# EAGLE design Watch (EAGLE 7.6.0)
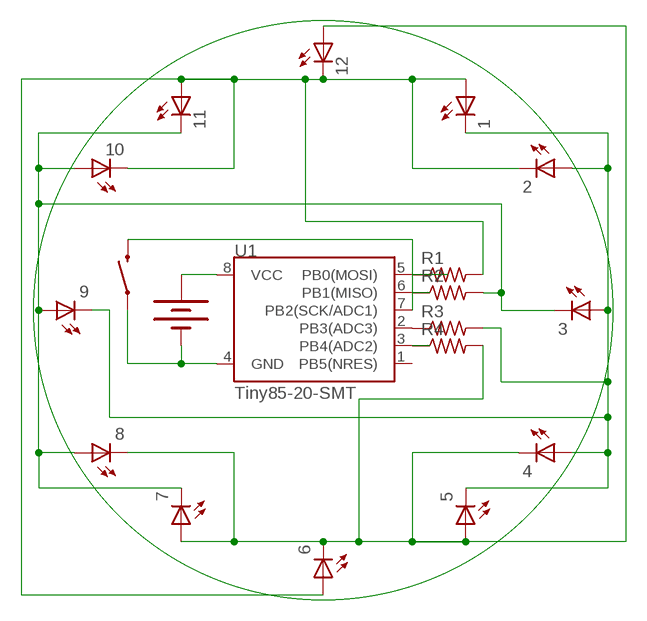
[diagram p0: schematic, sheet 1]

## Parts
1  LEDCHIPLED_0805  [CHIPLED_0805]
2  LEDCHIPLED_0805  [CHIPLED_0805]
3  LEDCHIPLED_0805  [CHIPLED_0805]
4  LEDCHIPLED_0805  [CHIPLED_0805]
5  LEDCHIPLED_0805  [CHIPLED_0805]
6  LEDCHIPLED_0805  [CHIPLED_0805]
7  LEDCHIPLED_0805  [CHIPLED_0805]
8  LEDCHIPLED_0805  [CHIPLED_0805]
9  LEDCHIPLED_0805  [CHIPLED_0805]
10  LEDCHIPLED_0805  [CHIPLED_0805]
11  LEDCHIPLED_0805  [CHIPLED_0805]
12  LEDCHIPLED_0805  [CHIPLED_0805]
BAT1  20mm coincell  BATTERY20MM_4LEGS  [BATTCON_20MM_4LEGS]
R1  R-US_M0805  [M0805]
R2  R-US_M0805  [M0805]
R3  R-US_M0805  [M0805]
R4  R-US_M0805  [M0805]
S2  SWITCH-MOMENTARY-2SMD  [TACTILE-SWITCH-SMD]
U1  Tiny85-20-SMT  ATTINY45TINY45-20-SMT  [SO08-EIAJ]

## Nets
N$1: 1.C 2.A 3.A 4.A 5.C 9.C R3.2
N$2: 4.C 5.A 6.C 7.A 8.C 12.A R4.2
N$3: 3.C 7.C 8.A 9.A 10.A 11.C R2.2
N$4: 1.A 2.C 6.A 10.C 11.A 12.C R1.2
N$5: R1.1 U1.5(PB0(MOSI))
N$6: R2.1 U1.6(PB1(MISO))
N$7: R3.1 U1.2(PB3(ADC3))
N$8: R4.1 U1.3(PB4(ADC2))
N$9: BAT1.NEGATIVE(-) S2.1 U1.4(GND)
N$10: S2.3 U1.7(PB2(SCK/ADC1))
N$12: BAT1.POSITIVE@1(+) BAT1.POSITIVE@2(+) BAT1.POSITIVE@3(+) BAT1.POSITIVE@4(+) U1.8(VCC)
Unconnected: U1.1(PB5(NRES))

## Library data of the parts
1-12 = adafruit:LED: LED OSRAM: - CHIPLED LG R971, LG N971, LY N971, LG Q971, LY Q971, LO R971, LY R971 LH N974, LH R974 LS Q976, LO Q976, LY Q976 LO Q996 - Hyper CHIPLED LW Q18S LB Q993, LB Q99A, LB R99A - SideLED LS A670, LO A670, LY A670, LG A670, LP A670 LB A673, LV A673, LT A673, LW A673 LH A674 LY A675 LS A676, LA A676, LO A676, LY A676, LW A676 LS A679, LY A679, LG A679 - Hyper Micro SIDELED® LS Y876, LA Y876, LO Y876, LY Y876 LT Y87S - SmartLED LW L88C, LW L88S LB L89C, LB L89S, LG L890 LS L89K, LO L89K, LY L89K LS L896, LA L896, LO L896, LY L896 - TOPLED LS T670, LO T670, LY T670, LG T670, LP T670 LSG T670, LSP T670, LSY T670, LOP T670, LYG T670 LG T671, LOG T671, LSG T671 LB T673, LV T673, LT T673, LW T673 LH T674 LS T676, LA T676, LO T676, LY T676, LB T676, LH T676, LSB T676, LW T676 LB T67C, LV T67C, LT T67C, LS T67K, LO T67K, LY T67K, LW E67C LS E67B, LA E67B, LO E67B, LY E67B, LB E67C, LV E67C, LT E67C LW T67C LS T679, LY T679, LG T679 LS T770, LO T770, LY T770, LG T770, LP T770 LB T773, LV T773, LT T773, LW T773 LH T774 LS E675, LA E675, LY E675, LS T675 LS T776, LA T776, LO T776, LY T776, LB T776 LHGB T686 LT T68C, LB T68C - Hyper Mini TOPLED® LB M676 - Mini TOPLED Santana® LG M470 LS M47K, LO M47K, LY M47K Source: http://www.osram.convergy.de/
BAT1 = SparkFun-Electromechanical:BATTERY: Battery Holders Various common sizes : AA, AAA, 18650 (PRT-12895), 20mm coin cell and 12mm coin cell. 20MM_4LEGS, BATT-10373; PROD_ID: BATT-10373
R1-R4 = adafruit:R-US_: RESISTOR, American symbol
S2 = SparkFun-Electromechanical:SWITCH-MOMENTARY-2: Various NO switches- pushbuttons, reed, etc; PROD_ID: SWCH-08247
U1 = SparkFun-DigitalIC:ATTINY45: Atmel 8-pin 2/4/8kB flash uC; PROD_ID: IC-08922; VALUE: Tiny45-20-SMT

## Board
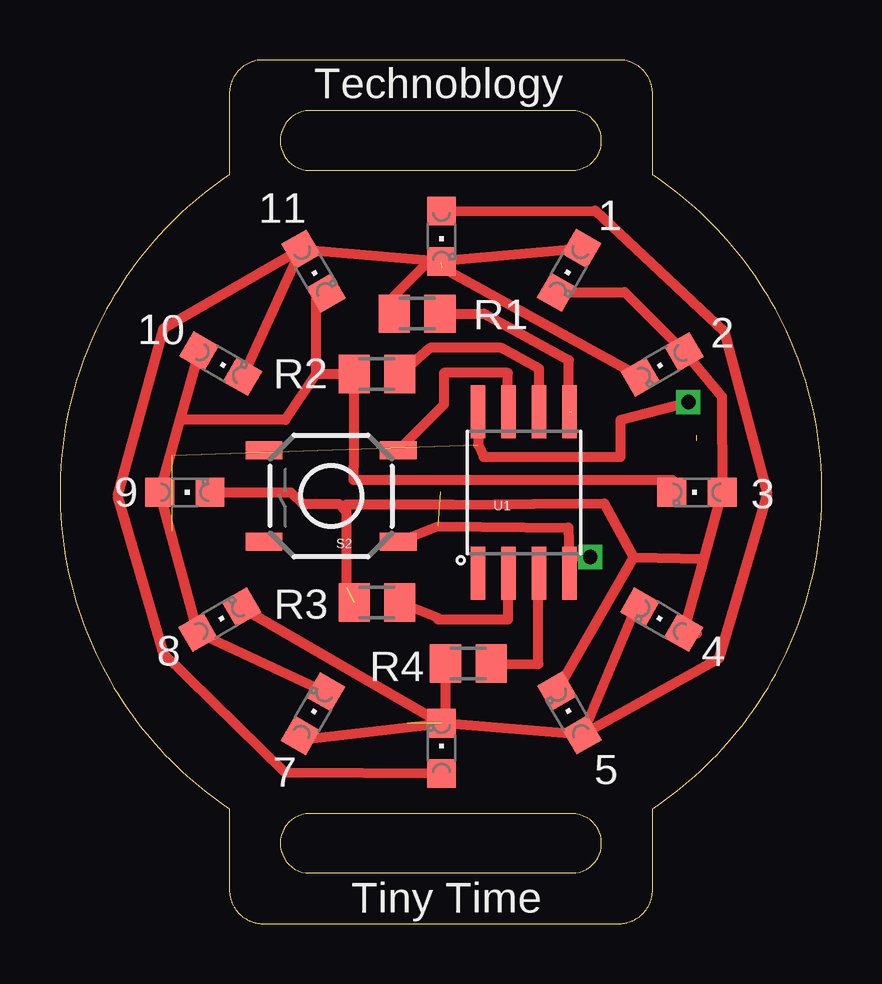
[diagram p1: board, top side]
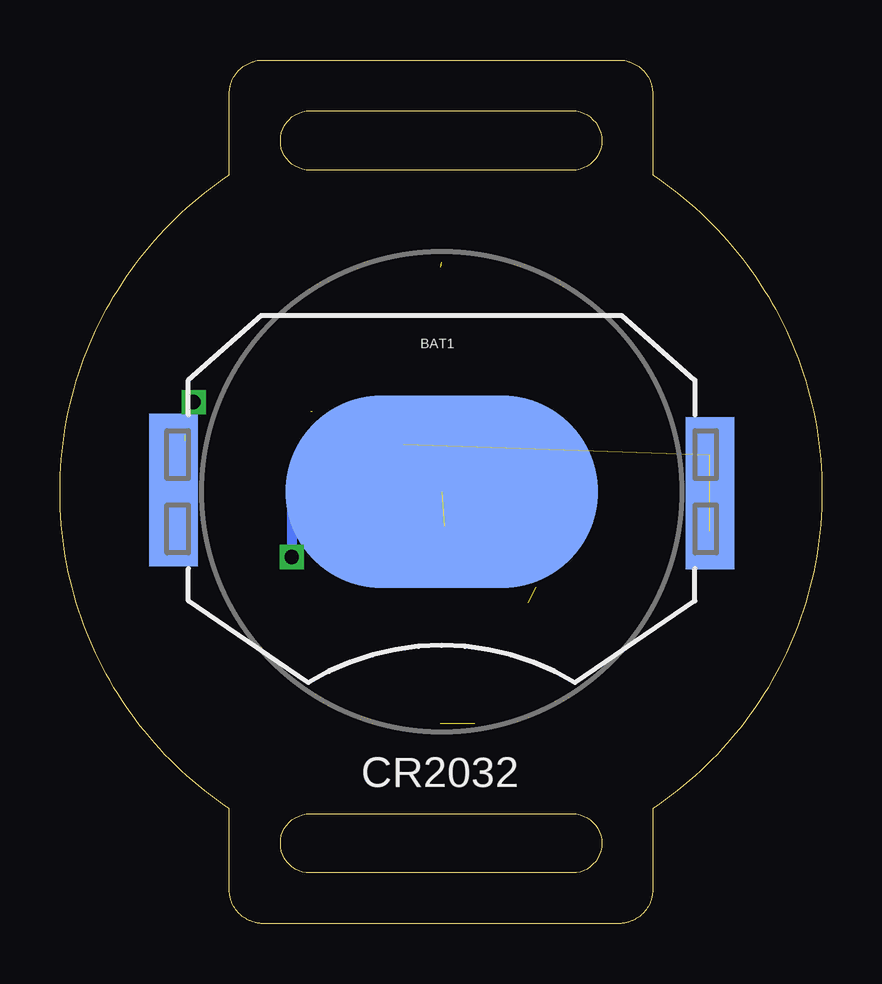
[diagram p2: board, bottom side, seen from below]

Size 31.75 x 35.98 mm. Coordinates in mm from the lower left corner, seen from the top.
Outline: 7.23,0.74 7.2,0.78 7.18,0.82 7.17,0.86 7.15,0.9 7.13,0.95 7.12,0.99 7.11,1.04 7.09,1.08 7.08,1.13 7.08,1.17 7.07,1.22 7.06,1.27 7.06,1.31 7.06,1.36 7.06,4.79 6.79,4.97 6.53,5.15 6.28,5.35 6.02,5.54 5.77,5.74 5.53,5.95 5.29,6.16 5.05,6.37 4.82,6.59 4.6,6.82 4.37,7.05 4.16,7.28 3.94,7.52 3.74,7.76 3.33,8.25 3.14,8.51 2.77,9.03 2.59,9.29 2.42,9.56 2.25,9.84 2.09,10.11 1.78,10.68 1.63,10.96 1.5,11.26 1.36,11.55 1.23,11.85 1.11,12.15 0.99,12.45 0.88,12.75 0.78,13.06 0.68,13.37 0.59,13.69 0.5,14.01 0.42,14.33 0.35,14.65 0.29,14.97 0.22,15.3 0.17,15.63 0.09,16.29 0.05,16.63 0.03,16.97 0.01,17.31 0,17.65 0,18.34 0.01,18.68 0.03,19.02 0.05,19.35 0.09,19.69 0.13,20.02 0.17,20.35 0.22,20.68 0.29,21.01 0.35,21.33 0.42,21.66 0.5,21.98 0.59,22.29 0.68,22.61 0.78,22.92 0.88,23.23 0.99,23.53 1.11,23.84 1.23,24.14 1.36,24.43 1.5,24.73 1.63,25.02 1.78,25.31 1.93,25.59 2.09,25.87 2.25,26.15 2.42,26.42 2.59,26.69 2.77,26.96 3.14,27.48 3.33,27.73 3.53,27.98 3.74,28.23 3.94,28.47 4.16,28.7 4.37,28.94 4.6,29.17 4.82,29.39 5.05,29.61 5.29,29.83 5.53,30.03 5.77,30.24 6.02,30.44 6.28,30.64 6.53,30.83 6.79,31.01 7.06,31.19 7.06,34.62 7.06,34.67 7.06,34.72 7.07,34.76 7.08,34.81 7.08,34.86 7.09,34.9 7.11,34.95 7.12,34.99 7.13,35.04 7.15,35.08 7.17,35.12 7.18,35.16 7.2,35.2 7.23,35.24 7.25,35.28 7.27,35.32 7.3,35.36 7.32,35.4 7.35,35.43 7.38,35.47 7.41,35.5 7.44,35.54 7.5,35.6 7.53,35.63 7.57,35.66 7.6,35.69 7.64,35.72 7.68,35.74 7.72,35.77 7.75,35.79 7.79,35.81 7.83,35.83 7.88,35.85 7.92,35.87 7.96,35.89 8,35.91 8.05,35.92 8.09,35.93 8.14,35.94 8.23,35.96 8.28,35.97 8.32,35.98 8.37,35.98 8.42,35.98 23.33,35.98 23.38,35.98 23.43,35.98 23.48,35.97 23.52,35.96 23.61,35.94 23.66,35.93 23.7,35.92 23.75,35.91 23.79,35.89 23.83,35.87 23.88,35.85 23.92,35.83 23.96,35.81 24,35.79 24.04,35.77 24.07,35.74 24.11,35.72 24.15,35.69 24.18,35.66 24.22,35.63 24.25,35.6 24.28,35.57 24.31,35.54 24.34,35.5 24.37,35.47 24.4,35.43 24.43,35.4 24.45,35.36 24.48,35.32 24.5,35.28 24.52,35.24 24.55,35.2 24.57,35.16 24.58,35.12 24.6,35.08 24.62,35.04 24.63,34.99 24.65,34.95 24.66,34.9 24.67,34.86 24.68,34.81 24.68,34.76 24.69,34.72 24.69,34.67 24.69,34.62 24.69,31.19 24.96,31.01 25.22,30.83 25.48,30.64 25.73,30.44 25.98,30.24 26.46,29.83 26.7,29.61 26.93,29.39 27.15,29.17 27.38,28.94 27.59,28.7 27.81,28.47 28.02,28.23 28.22,27.98 28.42,27.73 28.61,27.48 28.98,26.96 29.16,26.69 29.33,26.42 29.5,26.15 29.66,25.87 29.82,25.59 29.97,25.31 30.12,25.02 30.25,24.73 30.39,24.43 30.52,24.14 30.64,23.84 30.76,23.53 30.87,23.23 30.97,22.92 31.07,22.61 31.16,22.29 31.25,21.98 31.33,21.66 31.4,21.33 31.46,21.01 31.53,20.68 31.58,20.35 31.62,20.02 31.66,19.69 31.7,19.35 31.74,18.68 31.75,18.34 31.75,17.65 31.74,17.31 31.7,16.63 31.66,16.29 31.58,15.63 31.53,15.3 31.46,14.97 31.4,14.65 31.33,14.33 31.25,14.01 31.16,13.69 31.07,13.37 30.97,13.06 30.87,12.75 30.76,12.45 30.64,12.15 30.52,11.85 30.39,11.55 30.25,11.26 30.12,10.96 29.97,10.68 29.82,10.39 29.66,10.11 29.5,9.84 29.33,9.56 29.16,9.29 28.98,9.03 28.61,8.51 28.42,8.25 28.22,8.01 28.02,7.76 27.81,7.52 27.59,7.28 27.38,7.05 27.15,6.82 26.93,6.59 26.7,6.37 26.46,6.16 25.98,5.74 25.73,5.54 25.48,5.35 25.22,5.15 24.96,4.97 24.69,4.79 24.69,1.36 24.69,1.31 24.69,1.27 24.68,1.22 24.68,1.17 24.67,1.13 24.66,1.08 24.65,1.04 24.63,0.99 24.62,0.95 24.6,0.9 24.58,0.86 24.57,0.82 24.55,0.78 24.52,0.74 24.5,0.7 24.48,0.66 24.45,0.62 24.43,0.58 24.4,0.55 24.37,0.51 24.34,0.48 24.31,0.45 24.28,0.41 24.25,0.38 24.22,0.35 24.18,0.32 24.15,0.29 24.11,0.27 24.07,0.24 24.04,0.22 24,0.19 23.96,0.17 23.92,0.15 23.88,0.13 23.83,0.11 23.79,0.09 23.75,0.08 23.66,0.05 23.61,0.04 23.57,0.03 23.52,0.02 23.48,0.01 23.43,0.01 23.38,0 23.33,0 8.42,0 8.37,0 8.32,0.01 8.28,0.01 8.23,0.02 8.18,0.03 8.14,0.04 8.09,0.05 8.05,0.06 8,0.08 7.96,0.09 7.92,0.11 7.88,0.13 7.83,0.15 7.79,0.17 7.75,0.19 7.72,0.22 7.68,0.24 7.64,0.27 7.6,0.29 7.57,0.32 7.53,0.35 7.5,0.38 7.47,0.41 7.44,0.45 7.41,0.48 7.38,0.51 7.35,0.55 7.32,0.58 7.3,0.62 7.27,0.66 7.25,0.7
Outline: 21.5,33.86 10.24,33.86 10.08,33.82 9.93,33.76 9.79,33.7 9.65,33.61 9.54,33.5 9.43,33.39 9.34,33.25 9.28,33.11 9.21,32.96 9.18,32.79 9.18,32.45 9.21,32.29 9.28,32.14 9.34,32 9.43,31.86 9.54,31.75 9.65,31.64 9.79,31.55 9.93,31.49 10.08,31.42 10.24,31.39 21.5,31.39 21.66,31.42 21.81,31.49 21.96,31.55 22.09,31.64 22.2,31.75 22.31,31.86 22.4,32 22.47,32.14 22.53,32.29 22.56,32.45 22.56,32.79 22.53,32.96 22.47,33.11 22.4,33.25 22.31,33.39 22.2,33.5 22.09,33.61 21.96,33.7 21.81,33.76 21.66,33.82 21.5,33.86
Outline: 21.5,4.58 10.24,4.58 10.08,4.55 9.93,4.48 9.79,4.42 9.65,4.33 9.54,4.22 9.43,4.11 9.34,3.97 9.28,3.83 9.21,3.68 9.18,3.52 9.18,3.17 9.21,3.01 9.28,2.86 9.34,2.72 9.43,2.58 9.54,2.47 9.65,2.36 9.79,2.27 9.93,2.21 10.08,2.15 10.24,2.11 21.5,2.11 21.66,2.15 21.81,2.21 21.96,2.27 22.09,2.36 22.2,2.47 22.31,2.58 22.4,2.72 22.47,2.86 22.53,3.01 22.56,3.17 22.56,3.52 22.53,3.68 22.47,3.83 22.4,3.97 22.31,4.11 22.2,4.22 22.09,4.33 21.96,4.42 21.81,4.48 21.66,4.55 21.5,4.58
Copper layers (1*16): Top 0.035mm / dielectric 1.5mm / Bottom 0.035mm
Design rules "default": minimum track width 10mil, minimum drill 24mil, track to track 8mil, track to pad 8mil, pad to pad 8mil, via to via 8mil, smd to smd 8mil, copper to edge 40mil, drill to drill 8mil, minimum pad ring 10mil, minimum via ring 8mil, stop-mask expansion 4mil, vias tented up to drill 0mil, thermal gap 10mil

### Footprints (pad centres in the part's own frame; a part is rotated, then mirrored left to right if it is on the bottom)
CHIPLED_0805 = smd 1.2 x 1.2: A 0,-1.05; C 0,1.05
BATTCON_20MM_4LEGS = smd 13 x 8: NEGATIVE 0,0 | smd 2.032 x 3.175: POSITIVE@1 -11.176,1.651; POSITIVE@2 -11.176,-1.524; POSITIVE@3 11.176,1.524; POSITIVE@4 11.176,-1.651
M0805 = smd 1.3 x 1.6: 1 -0.95,0; 2 0.95,0
TACTILE-SWITCH-SMD = smd 1.524 x 0.762: 1 -2.794,1.905; 2 2.794,1.905; 3 -2.794,-1.905; 4 2.794,-1.905
SO08-EIAJ = smd 0.61 x 2.21: 1 -1.905,-3.378; 2 -0.635,-3.378; 3 0.635,-3.378; 4 1.905,-3.378; 5 1.905,3.353; 6 0.635,3.353; 7 -0.635,3.353; 8 -1.905,3.353

### Placement (x,y rotation side)
1  21.21,27.22 150 top
2  25.09,23.3 120 top
3  26.54,17.97 90 top
4  25.07,12.66 60 top
5  21.23,8.78 30 top
6  15.9,7.3 0 top
7  10.54,8.75 330 top
8  6.65,12.66 300 top
9  5.2,17.97 270 top
10  6.7,23.33 240 top
11  10.56,27.19 210 top
12  15.9,28.64 180 top
BAT1  15.85,18 0 bottom
R1  14.88,25.41 180 top
R2  13.2,22.9 180 top
R3  13.2,13.37 180 top
R4  17.01,10.83 180 top
S2  11.3,17.82 180 top
U1  19.33,17.97 0 top

### Tracks (layer width: path | path; a pad name or v marks a point on that pad's centre or on a via)
N$1  (1 unrouted)
  Top 0.406: 26,24.17 2.A | 26.54,12.08 25.98,12.08 4.A 26.82,15.2 | 5.C 23.9,15.27 | 23.9,15.27 22.68,17.51 19.73,17.49 16.38,17.46 11.93,17.46 11.93,17.18 | 11.93,17.18 11.93,14.01 | 26.82,15.2 3.A 27.58,21.96 2.A | 23.9,15.27 26.82,15.2 | 1.C 23.52,26.31 2.A | 9.C 9.62,17.97 10.11,17.49 11.63,17.49 11.93,17.18
N$2  (1 unrouted)
  Top 0.406: 4.C 24,13.19 5.A | 7.A 10.01,7.66 6.C | 21.76,7.66 5.A | 5.A 6.C | 12.A 22.3,29.7 27.68,24.65 29.46,17.92 27.45,11.04 5.A | 8.C 6.C | 6.C 16.06,8.35 R4.2
N$3
  Top 0.406: 9.A 4.31,17.97 | 10.A 5.81,23.85 | 11.3,9.66 7.C 8.A 9.A | 10.A | 11.C 11.09,26 10.66,26 10.66,22.9 | 10.66,22.9 9.39,20.99 5,21 | 25.27,17.97 3.C 25.52,17.97 25.52,18.48 12.24,18.48 12.24,19.04 12.25,19.04 R2.2 10.66,22.9 | 10.A 5,21 | 5,21 9.A
N$4  (1 unrouted)
  Top 0.406: 15.87,27.55 12.C | 11.A 12.C | 1.A 12.C | 11.A 10.C | 6.A 9.39,6.29 4.31,11.24 2.41,17.82 4.31,24.8 11.A | 15.9,27.34 2.C | 12.C 15.35,27.59 13.93,26.16 R1.2
N$5  (1 unrouted)
  Top 0.406: U1.5 21.21,21.32 21.21,23.48 17.67,25.41 R1.1
N$6
  Top 0.406: U1.6 19.96,23.13 18.39,23.99 15.41,23.99 R2.1
N$7
  Top 0.406: U1.2 18.67,14.59 18.67,12.66 15.74,12.66 15.74,12.74 R3.1
N$8
  Top 0.406: R4.1 19.94,10.81 19.94,13.91 U1.3
N$9  (via drill 0.6)  (1 unrouted)
  Top 0.406: S2.1 15.74,16.55 21.18,16.5 21.21,15.27 | 21.21,15.27 U1.4 21.28,14.64 | v22.09,15.28 21.21,15.28 21.21,15.27
  Bottom 0.406: 18.74,18 22.09,18 v22.09,15.28
N$10
  Top 0.406: U1.7 arc-90 18.67,21.35 18.67,22.95 16,22.95 16,21.63 S2.3
N$12  (via drill 0.6)  (3 unrouted)
  Top 0.406: U1.8 17.42,19.95 17.65,19.44 23.36,19.44 23.36,20.99 v26.18,21.73
  Bottom 0.406: BAT1.POSITIVE@2 26.54,16.95 26.54,20.36 | v26.18,21.73 26.54,20.13 BAT1.POSITIVE@1
N$41
  Top 0: 29.5,26.15 29.33,26.42 29.16,26.69 28.98,26.96 28.61,27.48 28.42,27.73 28.22,27.98 28.02,28.23 27.81,28.47 27.59,28.7 27.38,28.94 27.15,29.17 26.93,29.39 26.7,29.61 26.46,29.83 25.98,30.24 25.73,30.44 25.48,30.64 25.22,30.83 24.96,31.01 24.69,31.19 24.69,34.62 24.69,34.67 24.69,34.72 24.68,34.76 24.68,34.81 24.67,34.86 24.66,34.9 24.65,34.95 24.63,34.99 24.62,35.04 24.6,35.08 24.58,35.12 24.57,35.16 24.55,35.2 24.52,35.24 24.5,35.28 24.48,35.32 24.45,35.36 24.43,35.4 24.4,35.43 24.37,35.47 24.34,35.5 24.31,35.54 24.28,35.57 24.25,35.6 24.22,35.63 24.18,35.66 24.15,35.69 24.11,35.72 24.07,35.74 24.04,35.77 24,35.79 23.96,35.81 23.92,35.83 23.88,35.85 23.83,35.87 23.79,35.89 23.75,35.91 23.7,35.92 23.66,35.93 23.61,35.94 23.52,35.96 23.48,35.97 23.43,35.98 23.38,35.98 23.33,35.98 8.42,35.98 8.37,35.98 8.32,35.98 8.28,35.97 8.23,35.96 8.14,35.94 8.09,35.93 8.05,35.92 8,35.91 7.96,35.89 7.92,35.87 7.88,35.85 7.83,35.83 7.79,35.81 7.75,35.79 7.72,35.77 7.68,35.74 7.64,35.72 7.6,35.69 7.57,35.66 7.53,35.63 7.5,35.6 7.44,35.54 7.41,35.5 7.38,35.47 7.35,35.43 7.32,35.4 7.3,35.36 7.27,35.32 7.25,35.28 7.23,35.24 7.2,35.2 7.18,35.16 7.17,35.12 7.15,35.08 7.13,35.04 7.12,34.99 7.11,34.95 7.09,34.9 7.08,34.86 7.08,34.81 7.07,34.76 7.06,34.72 7.06,34.67 7.06,34.62 7.06,31.19 6.79,31.01 6.53,30.83 6.28,30.64 6.02,30.44 5.77,30.24 5.53,30.03 5.29,29.83 5.05,29.61 4.82,29.39 4.6,29.17 4.37,28.94 4.16,28.7 3.94,28.47 3.74,28.23 3.53,27.98 3.33,27.73 3.14,27.48 2.77,26.96 2.59,26.69 2.42,26.42 2.25,26.15 2.09,25.87 1.93,25.59 1.78,25.31 1.63,25.02 1.5,24.73 1.36,24.43 1.23,24.14 1.11,23.84 0.99,23.53 0.88,23.23 0.78,22.92 0.68,22.61 0.59,22.29 0.5,21.98 0.42,21.66 0.35,21.33 0.29,21.01 0.22,20.68 0.17,20.35 0.13,20.02 0.09,19.69 0.05,19.35 0.03,19.02 0.01,18.68 0,18.34 0,17.65 0.01,17.31 0.03,16.97 0.05,16.63 0.09,16.29 0.17,15.63 0.22,15.3 0.29,14.97 0.35,14.65 0.42,14.33 0.5,14.01 0.59,13.69 0.68,13.37 0.78,13.06 0.88,12.75 0.99,12.45 1.11,12.15
N$43
  Top 0: 21.5,33.86 10.24,33.86 10.08,33.82 9.93,33.76 9.79,33.7 9.65,33.61 9.54,33.5 9.43,33.39 9.34,33.25 9.28,33.11 9.21,32.96 9.18,32.79 9.18,32.45 9.21,32.29 9.28,32.14 9.34,32 9.43,31.86 9.54,31.75 9.65,31.64 9.79,31.55 9.93,31.49 10.08,31.42 10.24,31.39 21.5,31.39 21.66,31.42 21.81,31.49 21.96,31.55 22.09,31.64 22.2,31.75 22.31,31.86 22.4,32 22.47,32.14 22.53,32.29 22.56,32.45 22.56,32.79 22.53,32.96 22.47,33.11 22.4,33.25 22.31,33.39 22.2,33.5 22.09,33.61 21.96,33.7 21.81,33.76 21.66,33.82 21.5,33.86
N$44
  Top 0: 21.5,4.58 10.24,4.58 10.08,4.55 9.93,4.48 9.79,4.42 9.65,4.33 9.54,4.22 9.43,4.11 9.34,3.97 9.28,3.83 9.21,3.68 9.18,3.52 9.18,3.17 9.21,3.01 9.28,2.86 9.34,2.72 9.43,2.58 9.54,2.47 9.65,2.36 9.79,2.27 9.93,2.21 10.08,2.15 10.24,2.11 21.5,2.11 21.66,2.15 21.81,2.21 21.96,2.27 22.09,2.36 22.2,2.47 22.31,2.58 22.4,2.72 22.47,2.86 22.53,3.01 22.56,3.17 22.56,3.52 22.53,3.68 22.47,3.83 22.4,3.97 22.31,4.11 22.2,4.22 22.09,4.33 21.96,4.42 21.81,4.48 21.66,4.55 21.5,4.58
N$49
  Top 0: 21.71,7.89 23.3,8.76
N$50
  Top 0: 7.53,22.81 8.13,23.97
N$55
  Top 0: 24.22,13.17 23.62,12.01

### Text on the board
tNames: Technoblogy | Tiny Time
bNames: CR2032